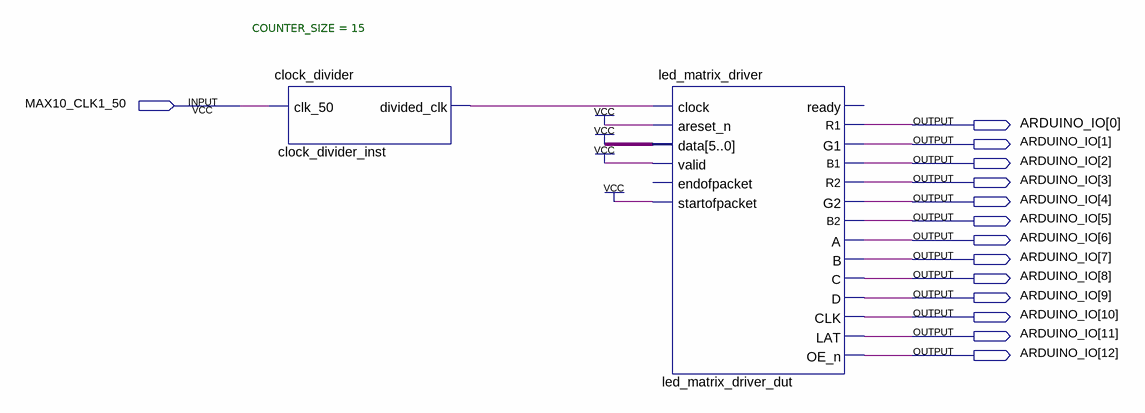
[diagram p0: schematic sheet]
// Quartus schematic led_matrix_driver_top.bdf as structural Verilog: 2 symbols, 14 pins
module led_matrix_driver_top (
  input  MAX10_CLK1_50,
  output [12:0] ARDUINO_IO
);

  wire clock_divider_inst_divided_clk;

  clock_divider #(.COUNTER_SIZE(15)) clock_divider_inst (
    .clk_50(MAX10_CLK1_50), .divided_clk(clock_divider_inst_divided_clk));
  led_matrix_driver led_matrix_driver_dut (
    .clock(clock_divider_inst_divided_clk), .areset_n(1'b1), .data({6{1'b1}}), .valid(1'b1),
    .startofpacket(1'b1), .R1(ARDUINO_IO[0]), .G1(ARDUINO_IO[1]), .B1(ARDUINO_IO[2]), .R2(ARDUINO_IO[3]),
    .G2(ARDUINO_IO[4]), .B2(ARDUINO_IO[5]), .A(ARDUINO_IO[6]), .B(ARDUINO_IO[7]), .C(ARDUINO_IO[8]),
    .D(ARDUINO_IO[9]), .CLK(ARDUINO_IO[10]), .LAT(ARDUINO_IO[11]), .OE_n(ARDUINO_IO[12]));  // open: endofpacket, ready
endmodule
